# Altium project Pohutakawa.PrjPcb
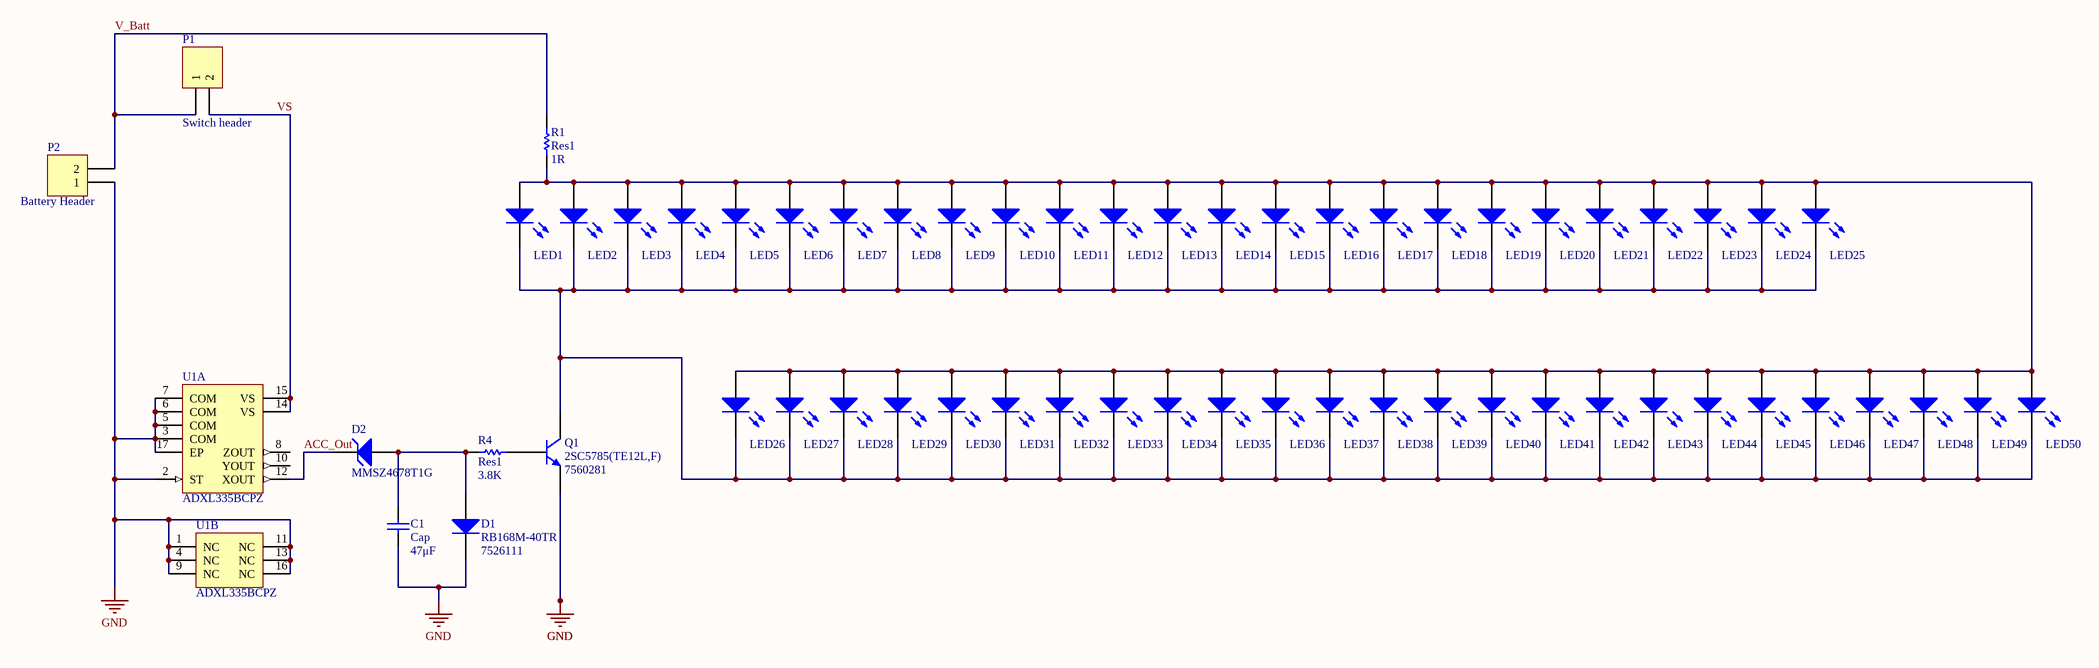
[diagram p0: Sheet1.SchDoc]
1 sheet, 59 parts. Net scope: global (net labels, ports and power ports of the same name join across sheets).
Board file: PCB1.PcbDoc

## Sheet Sheet1.SchDoc
size A1

### Parts
C1  Cap  value 47μF  [Capacitor 0603]
D1  RB168M-40TR  Supplier Part Number 1: 7526111  [SODFL350X90-2N]
D2  MMSZ4678T1G  [SODFL371X135-2N]
LED1  150080RS75000  [0805_A]  (value not drawn)
LED2  150080RS75000  [0805_A]  (value not drawn)
LED3  150080RS75000  [0805_A]  (value not drawn)
LED4  150080RS75000  [0805_A]  (value not drawn)
LED5  150080RS75000  [0805_A]  (value not drawn)
LED6  150080RS75000  [0805_A]  (value not drawn)
LED7  150080RS75000  [0805_A]  (value not drawn)
LED8  150080RS75000  [0805_A]  (value not drawn)
LED9  150080RS75000  [0805_A]  (value not drawn)
LED10  150080RS75000  [0805_A]  (value not drawn)
LED11  150080RS75000  [0805_A]  (value not drawn)
LED12  150080RS75000  [0805_A]  (value not drawn)
LED13  150080RS75000  [0805_A]  (value not drawn)
LED14  150080RS75000  [0805_A]  (value not drawn)
LED15  150080RS75000  [0805_A]  (value not drawn)
LED16  150080RS75000  [0805_A]  (value not drawn)
LED17  150080RS75000  [0805_A]  (value not drawn)
LED18  150080RS75000  [0805_A]  (value not drawn)
LED19  150080RS75000  [0805_A]  (value not drawn)
LED20  150080RS75000  [0805_A]  (value not drawn)
LED21  150080RS75000  [0805_A]  (value not drawn)
LED22  150080RS75000  [0805_A]  (value not drawn)
LED23  150080RS75000  [0805_A]  (value not drawn)
LED24  150080RS75000  [0805_A]  (value not drawn)
LED25  150080RS75000  [0805_A]  (value not drawn)
LED26  150080RS75000  [0805_A]  (value not drawn)
LED27  150080RS75000  [0805_A]  (value not drawn)
LED28  150080RS75000  [0805_A]  (value not drawn)
LED29  150080RS75000  [0805_A]  (value not drawn)
LED30  150080RS75000  [0805_A]  (value not drawn)
LED31  150080RS75000  [0805_A]  (value not drawn)
LED32  150080RS75000  [0805_A]  (value not drawn)
LED33  150080RS75000  [0805_A]  (value not drawn)
LED34  150080RS75000  [0805_A]  (value not drawn)
LED35  150080RS75000  [0805_A]  (value not drawn)
LED36  150080RS75000  [0805_A]  (value not drawn)
LED37  150080RS75000  [0805_A]  (value not drawn)
LED38  150080RS75000  [0805_A]  (value not drawn)
LED39  150080RS75000  [0805_A]  (value not drawn)
LED40  150080RS75000  [0805_A]  (value not drawn)
LED41  150080RS75000  [0805_A]  (value not drawn)
LED42  150080RS75000  [0805_A]  (value not drawn)
LED43  150080RS75000  [0805_A]  (value not drawn)
LED44  150080RS75000  [0805_A]  (value not drawn)
LED45  150080RS75000  [0805_A]  (value not drawn)
LED46  150080RS75000  [0805_A]  (value not drawn)
LED47  150080RS75000  [0805_A]  (value not drawn)
LED48  150080RS75000  [0805_A]  (value not drawn)
LED49  150080RS75000  [0805_A]  (value not drawn)
LED50  150080RS75000  [0805_A]  (value not drawn)
P1  Switch header  [HDR1X2]
P2  Battery Header  [HDR1X2]
Q1  2SC5785(TE12L,F)  Supplier Part Number 1: 7560281  [SOT89-150P410X160-3N]
R1  Res1  value 1R  [Resistor 1206]
R4  Res1  value 3.8K  [Resistor 1206]
U1  ADXL335BCPZ  [ADI-CP-16-14_L]  (parts A,B of 2)

### Nets
GND: C1.1 D1.2(K) P2.1 Q1.3(E) U1.1(NC) U1.2(ST) U1.3(COM) U1.4(NC) U1.5(COM) U1.6(COM) U1.7(COM) U1.9(NC) U1.11(NC) U1.13(NC) U1.16(NC) U1.17(EP)
ACC_Out: D2.1(K) U1.12(XOUT)
V_Batt: P1.1 P2.2 R1.2
VS: P1.2 U1.14(VS) U1.15(VS)
NetC1_2: C1.2 D1.1(A) D2.2(A) R4.1
NetLED1_1: LED1.1(K) LED2.1(K) LED3.1(K) LED4.1(K) LED5.1(K) LED6.1(K) LED7.1(K) LED8.1(K) LED9.1(K) LED10.1(K) LED11.1(K) LED12.1(K) LED13.1(K) LED14.1(K) LED15.1(K) LED16.1(K) LED17.1(K) LED18.1(K) LED19.1(K) LED20.1(K) LED21.1(K) LED22.1(K) LED23.1(K) LED24.1(K) LED25.1(K) LED26.1(K) LED27.1(K) LED28.1(K) LED29.1(K) LED30.1(K) LED31.1(K) LED32.1(K) LED33.1(K) LED34.1(K) LED35.1(K) LED36.1(K) LED37.1(K) LED38.1(K) LED39.1(K) LED40.1(K) LED41.1(K) LED42.1(K) LED43.1(K) LED44.1(K) LED45.1(K) LED46.1(K) LED47.1(K) LED48.1(K) LED49.1(K) LED50.1(K) Q1.2(C)
NetLED1_2: LED1.2(A) LED2.2(A) LED3.2(A) LED4.2(A) LED5.2(A) LED6.2(A) LED7.2(A) LED8.2(A) LED9.2(A) LED10.2(A) LED11.2(A) LED12.2(A) LED13.2(A) LED14.2(A) LED15.2(A) LED16.2(A) LED17.2(A) LED18.2(A) LED19.2(A) LED20.2(A) LED21.2(A) LED22.2(A) LED23.2(A) LED24.2(A) LED25.2(A) LED26.2(A) LED27.2(A) LED28.2(A) LED29.2(A) LED30.2(A) LED31.2(A) LED32.2(A) LED33.2(A) LED34.2(A) LED35.2(A) LED36.2(A) LED37.2(A) LED38.2(A) LED39.2(A) LED40.2(A) LED41.2(A) LED42.2(A) LED43.2(A) LED44.2(A) LED45.2(A) LED46.2(A) LED47.2(A) LED48.2(A) LED49.2(A) LED50.2(A) R1.1
NetQ1_1: Q1.1(B) R4.2

Not connected (* = marked no-connect by the designer): U1 8(ZOUT) 10(YOUT)

### Library data of the parts
C1 = Cap: Capacitor; Published: 8-Jun-2000; LatestRevisionDate: 17-Jul-2002; LatestRevisionNote: Re-released for DXP Platform.; PackageReference: RAD-0.3; Publisher: Altium Limited; PackageDescription: Radial Cap, Thru-Hole; 2 Leads; 0.3 in Pin Spacing
D1 = RB168M-40TR: DIODE SCHOTTKY 40V 1A PMDU; Manufacturer: Rohm; Max Reverse Current: 50nA; Element Configuration: Single; Forward Voltage: 600mV; Max Forward Surge Current (Ifsm): 30A; Supplier 1: RSComponents; Manufacturer Part Number: RB168M-40TR; RoHS: Yes; Category: Rectifier Diodes; Stock 1: 1110; Mount: Surface Mount; Case/Package: SOD-123-2; Number of Pins: 2; Weight: 0.000363oz; Min Operating Temperature: -55°C; Max Operating Temperature: 150°C; Packaging: Tape and Reel; Forward Current: 1A; Package Quantity: 3000; Termination: SMD/SMT; Reverse Voltage (DC): 40V; Average Rectified Current: 1A; Max Repetitive Reverse Voltage (Vrrm): 40V; Peak Non-Repetitive Surge Current: 30A; Max Reverse Voltage (DC): 40V; Length: 2.6mm; Width: 1.6mm; Height: 0.8mm; Radiation Hardening: No; Lead Free: Lead Free; ComponentLink1URL: https://datasheet.ciiva.com/29592/rb168m-40-29592360.pdf?src-supplier=Digi-Key; ComponentLink1Description: https://datasheet.ciiva.com/29592/rb168m-40-29592360.pdf?src-supplier=Digi-Key; ComponentLink2URL: https://datasheet.ciiva.com/14920/diodekousei-14920856.pdf?src-supplier=Digi-Key; ComponentLink2Description: https://datasheet.ciiva.com/14920/diodekousei-14920856.pdf?src-supplier=Digi-Key; ComponentLink3URL: https://datasheet.ciiva.com/29592/diodekousei-29592361.pdf?src-supplier=Digi-Key; ComponentLink3Description: https://datasheet.ciiva.com/29592/diodekousei-29592361.pdf?src-supplier=Digi-Key
D2 = MMSZ4678T1G: ON SEMICONDUCTOR         MMSZ4678T1G.             ZENER DIODE, 500mW, 1.8V, SOD-123; Material: Plastic; Tolerance: 5%; Max Reverse Leakage Current: 7.5uA; Element Configuration: Single; Forward Voltage: 900mV; Zener Current: 50uA; Max Breakdown Voltage: 1.89V; ESD Protection: Yes; Supplier 1: Digi-Key; Manufacturer: ON Semiconductor; Manufacturer Part Number: MMSZ4678T1G; RoHS: Yes; Category: Zener Diodes; Stock 1: 39023; Pricing 1: 1=0.21000, 10=0.19300, 100=0.08090, 500=0.06350, 1000=0.04410 (USD); Case/Package: SOD-123-2; Number of Pins: 2; Contact Plating: Tin,Matte; Min Operating Temperature: -55°C; Max Operating Temperature: 150°C; Packaging: Tape and Reel; Max Power Dissipation: 500mW; Package Quantity: 1; Zener Voltage: 1.8V; Voltage Tolerance: 5%; Power Dissipation: 500mW; Test Current: 50uA; Working Voltage: 1.8V; Max Reverse Current: 50uA; Termination: SMD/SMT; Voltage Rating (DC): 1.8V; Power Rating: 500mW; Breakdown Voltage: 1.89V; Length: 0.111inch; Width: 0.071inch; Height: 0.053inch; Radiation Hardening: No; Lead Free: Lead Free; REACH SVHC: No SVHC; ComponentLink1URL: https://datasheet.ciiva.com/895/mmsz4678t1-d-895010.pdf?src-supplier=Digi-Key; ComponentLink1Description: https://datasheet.ciiva.com/895/mmsz4678t1-d-895010.pdf?src-supplier=Digi-Key; ComponentLink2URL: https://datasheet.ciiva.com/18435/70099545-18435515.pdf?src-supplier=Allied+Electronics; ComponentLink2Description: https://datasheet.ciiva.com/18435/70099545-18435515.pdf?src-supplier=Allied+Electronics; ComponentLink3URL: https://datasheet.ciiva.com/8346/mmsz4678t1-d-8346046.pdf?src-supplier=Avnet; ComponentLink3Description: https://datasheet.ciiva.com/8346/mmsz4678t1-d-8346046.pdf?src-supplier=Avnet; ComponentLink4URL: https://datasheet.ciiva.com/22697/1796559-22697910.pdf?src-supplier=Element14; ComponentLink4Description: https://datasheet.ciiva.com/22697/1796559-22697910.pdf?src-supplier=Element14; ComponentLink5URL: https://datasheet.ciiva.com/8026/mmsz4678t1-d-8026830.pdf?src-supplier=Element14; ComponentLink5Description: https://datasheet.ciiva.com/8026/mmsz4678t1-d-8026830.pdf?src-supplier=Element14; ComponentLink6URL: https://datasheet.ciiva.com/895/mmsz4678t1-d-895011.pdf?src-supplier=Digi-Key; ComponentLink6Description: https://datasheet.ciiva.com/895/mmsz4678t1-d-895011.pdf?src-supplier=Digi-Key; ComponentLink7URL: https://datasheet.ciiva.com/895/mmsz4678t1-d-895012.pdf?src-supplier=Digi-Key; ComponentLink7Description: https://datasheet.ciiva.com/895/mmsz4678t1-d-895012.pdf?src-supplier=Digi-Key; Supplier Part Number 1: MMSZ4678T1GOSCT-ND
LED1-LED50 = CMP-1426-00011-1: SMD mono-color Chip LED, WL-SMCW, Red; Manufacturer: Wuerth Elektronik; Color: Red; PartNumber: 150080RS75000; PackageReference: 0805_A; ComponentLink2Description: Datasheet; ComponentLink1URL: http://www.we-online.com; ComponentLink1Description: Manufacturer URL; ComponentLink2URL: http://katalog.we-online.com/led/datasheet/150080RS75000.pdf
P1 P2 = Header 2: Header, 2-Pin; LatestRevisionDate: 17-Jul-2002; LatestRevisionNote: Re-released for DXP Platform.; Publisher: Altium Limited
Q1 = 2SC5785(TE12L,F): NPN Bipolar Transistor, 2 A, 10 V, 3-Pin SC-62; Manufacturer: Toshiba; Supplier 1: RSComponents; Manufacturer Part Number: 2SC5785(TE12L,F); RoHS: No; Category: Uncategorized; Stock 1: 40
R1 R4 = Res1: Resistor; Published: 8-Jun-2000; LatestRevisionDate: 17-Jul-2002; LatestRevisionNote: Re-released for DXP Platform.; PackageReference: AXIAL-0.3; Publisher: Altium Limited; PackageDescription: Axial Device, Thru-Hole; 2 Leads; 0.3 in Pin Spacing
U1 = CMP-0885-00046-1: Small, Low Power, 3-Axis +/-3 g Accelerometer with Analog Output, 1.6 KHz BW, Industrial, 16-pin QFN, Tray; Manufacturer: Analog Devices; Sensitivity: 300 mV/g; Voltage Supply (V): 1.8 to 3.6; Supply Current: 350 uA; # of Axes: 3; -3dB Bandwidth: 1.6 KHz; ComponentLink4URL: http://www.analog.com/en/mems-sensors/mems-inertial-sensors/adxl335/products/product.html; PackageVersion: 051909-A, 05/2009; PackageReference: CP-16-14; PackageDescription: 16-Pin Lead Frame Chip Scale Package, 4 x 4 mm Body, 0.65 mm Pitch; ComponentLink1Description: Manufacturer URL; Code_JEDEC: MO-220-WGGD; PartNumber: ADXL335BCPZ; ComponentLink4Description: Product URL; ComponentLink1URL: http://www.analog.com/en/index.html; ComponentLink3URL: http:/www.analog.com/static/imported-files/packages/PKG_PDF/LFCSP(CP)/CP-16/CP_16_14.pdf; Mounting Technology: Surface Mount; ComponentLink3Description: Package Specification; Packing: Tray; Output Type: Analog; ComponentLink2URL: http://www.analog.com/static/imported-files/data_sheets/ADXL335.pdf; ComponentLink2Description: Datasheet; DatasheetVersion: Rev. B